# EAGLE schematic dac8 (EAGLE 5.06)
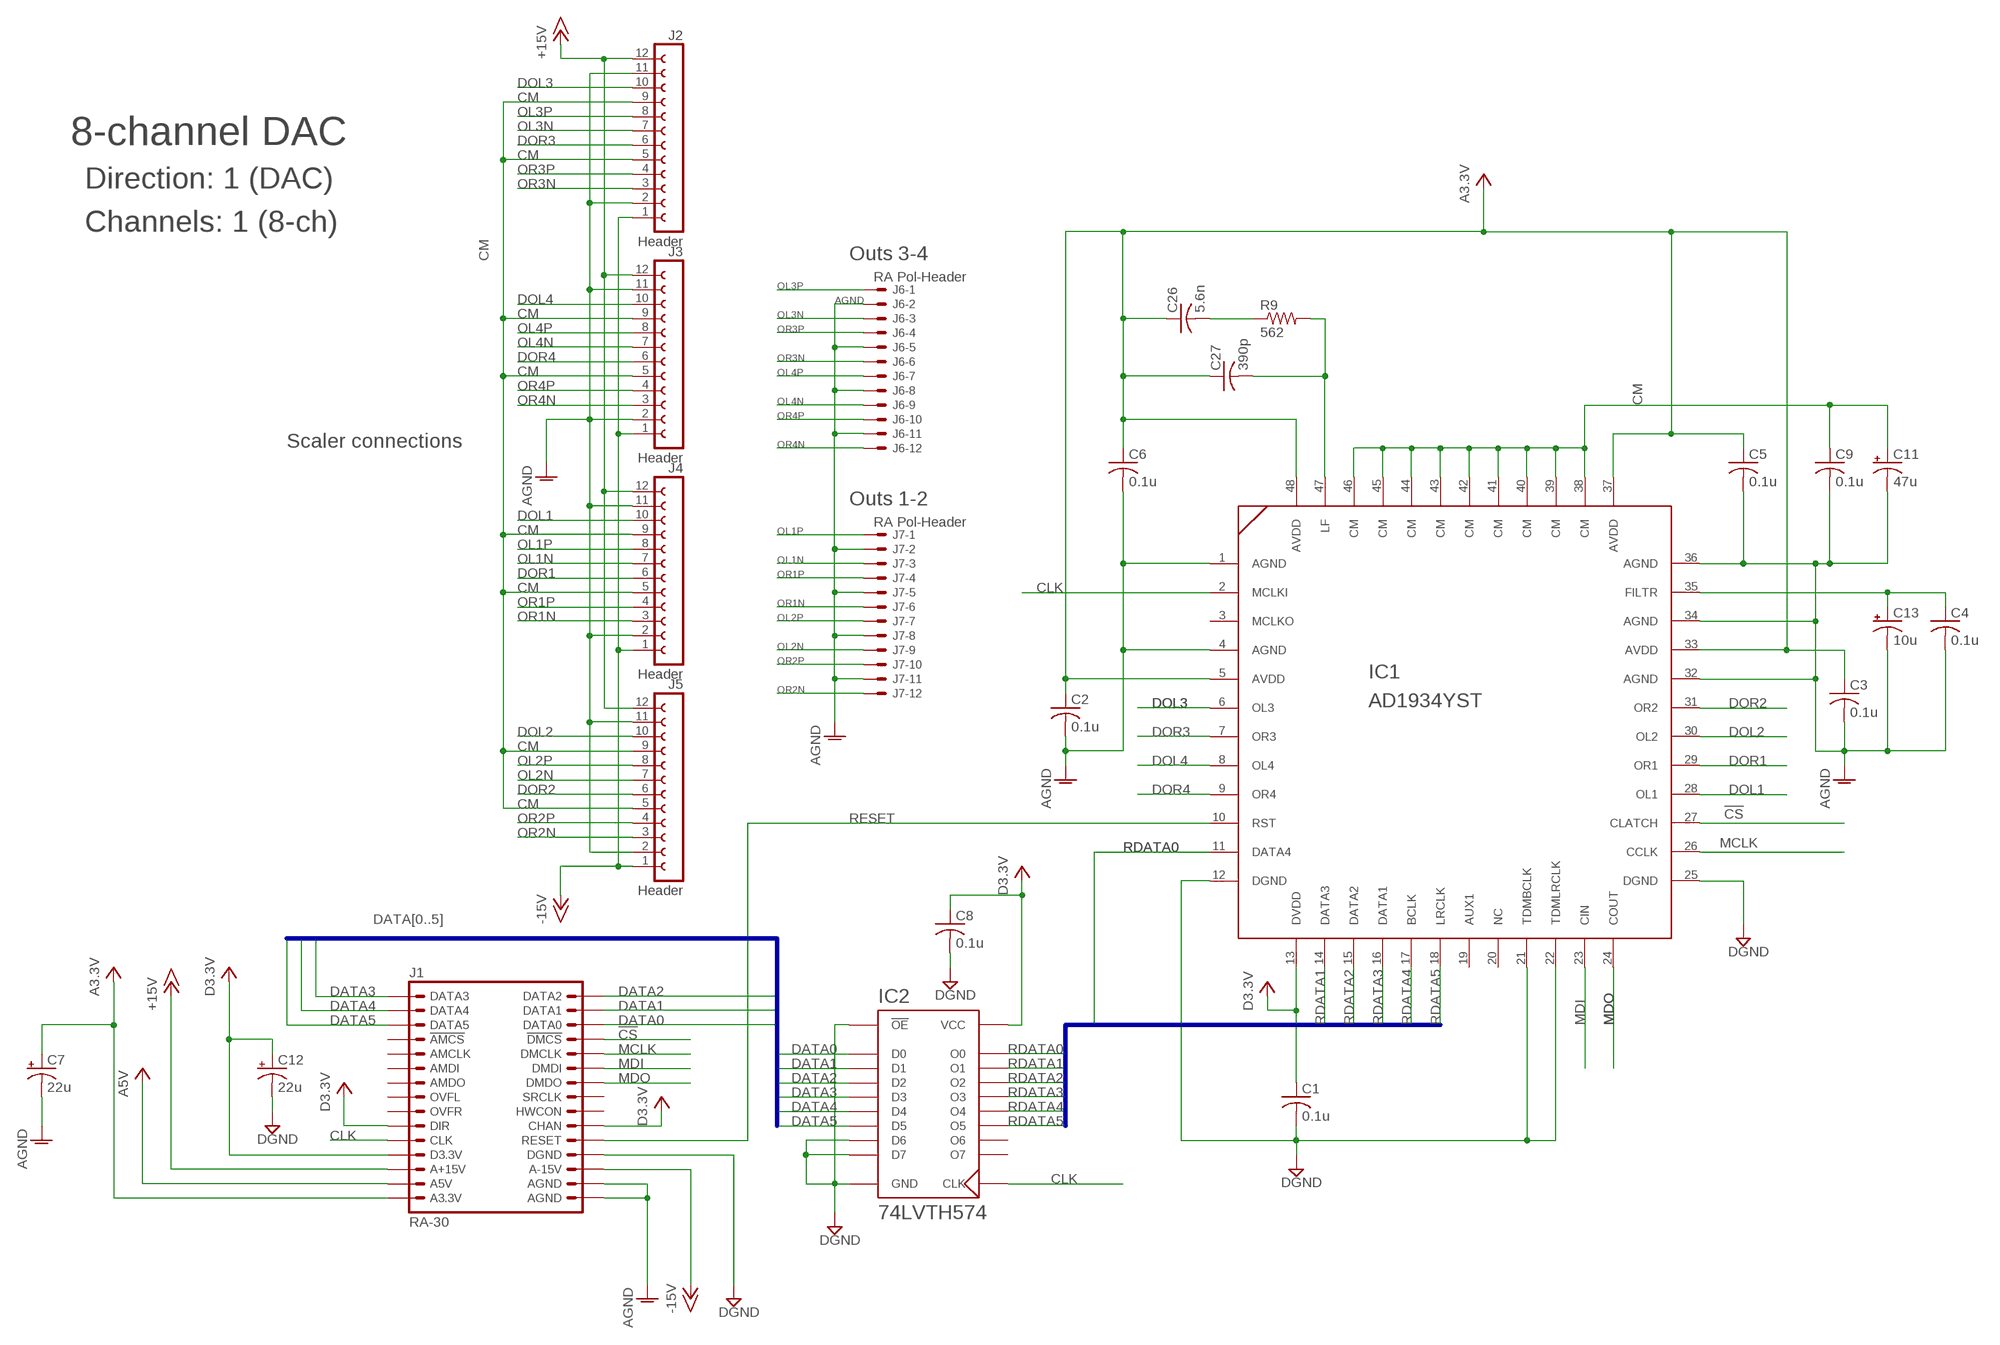
[diagram p0: schematic, sheet 1]

## Parts
C1  0.1u  C-USC1206  [C1206]
C2  0.1u  C-USC1206  [C1206]
C3  0.1u  C-USC1206  [C1206]
C4  0.1u  C-USC1206  [C1206]
C5  0.1u  C-USC1206  [C1206]
C6  0.1u  C-USC1206  [C1206]
C7  22u  CPOL-USB  [PANASONIC_B]
C8  0.1u  C-USC1206  [C1206]
C9  0.1u  C-USC1206  [C1206]
C11  47u  CPOL-USB  [PANASONIC_B]
C12  22u  CPOL-USB  [PANASONIC_B]
C13  10u  CPOL-USC/6032-28R  [C/6032-28R]
C26  5.6n  C-USC1206  [C1206]
C27  390p  C-USC1206  [C1206]
IC1  AD1934YST  [LQFP48]
IC2  74LVTH574  [TSSOP20]
J1  RA-30  [FCI-RA-30]
J2  Header  FE12-1  [FE12]
J3  Header  FE12-1  [FE12]
J4  Header  FE12-1  [FE12]
J5  Header  FE12-1  [FE12]
J6  RA Pol-Header  22-23-2121  [22-23-2121]
J7  RA Pol-Header  22-23-2121  [22-23-2121]
R9  562  R-US_R1206  [R1206]

## Nets
!CS: IC1.27(CLATCH) J1.P$A12(!DMCS)
+15V: J1.P$A28(A+15V) J2.12 J3.12 J4.12 J5.12
-15V: J1.P$A3(A-15V) J2.1 J3.1 J4.1 J5.1
A3.3V: C2.1 C3.1 C5.1 C6.1 C7.+ C26.1 C27.1 IC1.5(AVDD) IC1.33(AVDD) IC1.37(AVDD) IC1.48(AVDD) J1.P$A30(A3.3V)
A5V: J1.P$A29(A5V)
AGND: C2.2 C3.2 C4.2 C5.2 C6.2 C7.- C9.2 C11.- C13.- IC1.1(AGND) IC1.4(AGND) IC1.32(AGND) IC1.34(AGND) IC1.36(AGND) J1.P$A1(AGND) J1.P$A2(AGND) J2.2 J2.11 J3.2 J3.11 J4.2 J4.11 J5.2 J5.11 J6.2 J6.5 J6.8 J6.11 J7.2 J7.5 J7.8 J7.11
CLK: IC1.2(MCLKI) IC2.11(CLK) J1.P$A26(CLK)
CM: C9.1 C11.+ IC1.38(CM) IC1.39(CM) IC1.40(CM) IC1.41(CM) IC1.42(CM) IC1.43(CM) IC1.44(CM) IC1.45(CM) IC1.46(CM) J2.5 J2.9 J3.5 J3.9 J4.5 J4.9 J5.5 J5.9
D3.3V: C1.1 C8.1 C12.+ IC1.13(DVDD) IC2.20(VCC) J1.P$A6(CHAN) J1.P$A25(DIR) J1.P$A27(D3.3V)
DATA0: IC2.2(D0) J1.P$A13(DATA0)
DATA1: IC2.3(D1) J1.P$A14(DATA1)
DATA2: IC2.4(D2) J1.P$A15(DATA2)
DATA3: IC2.5(D3) J1.P$A16(DATA3)
DATA4: IC2.6(D4) J1.P$A17(DATA4)
DATA5: IC2.7(D5) J1.P$A18(DATA5)
DGND: C1.2 C8.2 C12.- IC1.12(DGND) IC1.21(TDMBCLK) IC1.22(TDMLRCLK) IC1.25(DGND) IC2.1(!OE) IC2.8(D6) IC2.9(D7) IC2.10(GND) J1.P$A4(DGND)
DOL1: IC1.28(OL1) J4.10
DOL2: IC1.30(OL2) J5.10
DOL3: IC1.6(OL3) J2.10
DOL4: IC1.8(OL4) J3.10
DOR1: IC1.29(OR1) J4.6
DOR2: IC1.31(OR2) J5.6
DOR3: IC1.7(OR3) J2.6
DOR4: IC1.9(OR4) J3.6
MCLK: IC1.26(CCLK) J1.P$A11(DMCLK)
MDI: IC1.23(CIN) J1.P$A10(DMDI)
MDO: IC1.24(COUT) J1.P$A9(DMDO)
N$7: C4.1 C13.+ IC1.35(FILTR)
N$11: C27.2 IC1.47(LF) R9.2
N$13: C26.2 R9.1
OL1N: J4.7 J7.3
OL1P: J4.8 J7.1
OL2N: J5.7 J7.9
OL2P: J5.8 J7.7
OL3N: J2.7 J6.3
OL3P: J2.8 J6.1
OL4N: J3.7 J6.9
OL4P: J3.8 J6.7
OR1N: J4.3 J7.6
OR1P: J4.4 J7.4
OR2N: J5.3 J7.12
OR2P: J5.4 J7.10
OR3N: J2.3 J6.6
OR3P: J2.4 J6.4
OR4N: J3.3 J6.12
OR4P: J3.4 J6.10
RDATA0: IC1.11(DATA4) IC2.19(O0)
RDATA1: IC1.14(DATA3) IC2.18(O1)
RDATA2: IC1.15(DATA2) IC2.17(O2)
RDATA3: IC1.16(DATA1) IC2.16(O3)
RDATA4: IC1.17(BCLK) IC2.15(O4)
RDATA5: IC1.18(LRCLK) IC2.14(O5)
RESET: IC1.10(RST) J1.P$A5(RESET)
Unconnected: IC1.3(MCLKO) IC1.19(AUX1) IC1.20(NC) IC2.12(O7) IC2.13(O6) J1.P$A7(HWCON) J1.P$A8(SRCLK) J1.P$A19(!AMCS) J1.P$A20(AMCLK) J1.P$A21(AMDI) J1.P$A22(AMDO) J1.P$A23(OVFL) J1.P$A24(OVFR)

## Buses
DATA[0..5]
RDATA[0..5]

## Notes on the sheet
- 8-channel DAC
- Direction: 1 (DAC)
- Channels: 1 (8-ch)
- Outs 3-4
- Scaler connections
- Outs 1-2

## Library data of the parts
C1-C6 C8 C9 C26 C27 = rcl:C-US: CAPACITOR, American symbol
C7 C11-C13 = rcl:CPOL-US: POLARIZED CAPACITOR, American symbol
IC1 = cdp:AD1934
IC2 = cdp:74LVTH574
J1 = cdp:RA-30
J2-J5 = con-lsta:FE12-1: FEMALE HEADER
J6 J7 = con-molex:22-23-2121: .100" (2.54mm) Center Header - 12 Pin
R9 = rcl:R-US_: RESISTOR, American symbol